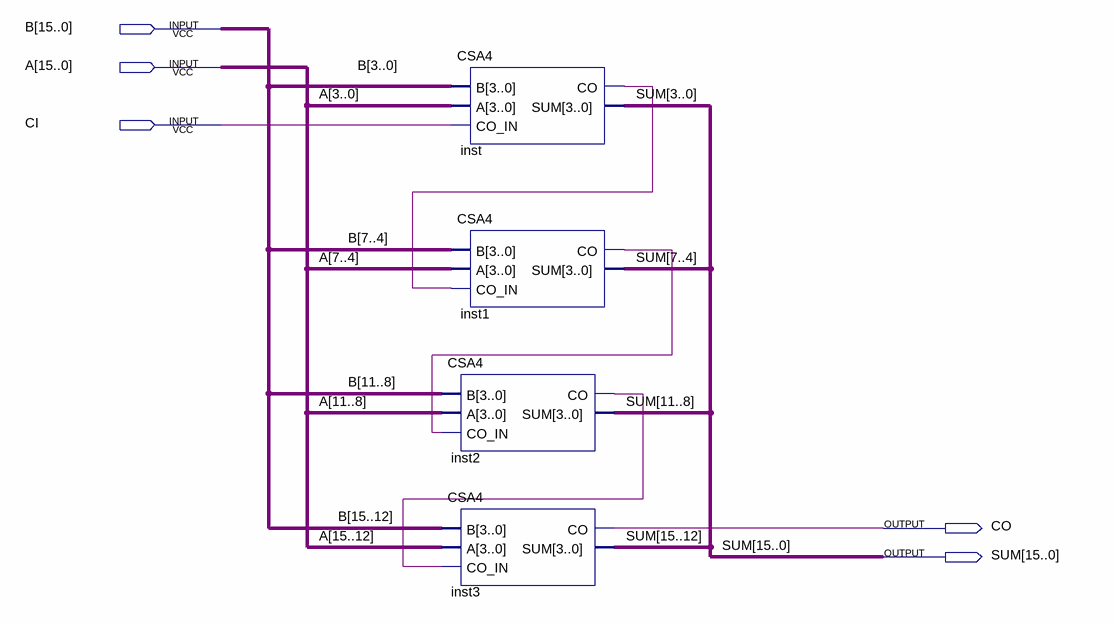
[diagram p0: schematic sheet]
// Quartus schematic CSA16.bdf as structural Verilog: 4 symbols, 5 pins
module CSA16 (
  input  [15:0] B,
  input  [15:0] A,
  input  CI,
  output CO,
  output [15:0] SUM
);

  wire inst1_co, inst2_co, inst_co;

  CSA4 inst (.B(B[3:0]), .A(A[3:0]), .CO_IN(CI), .CO(inst_co), .SUM(SUM[3:0]));
  CSA4 inst1 (.B(B[7:4]), .A(A[7:4]), .CO_IN(inst_co), .CO(inst1_co), .SUM(SUM[7:4]));
  CSA4 inst2 (.B(B[11:8]), .A(A[11:8]), .CO_IN(inst1_co), .CO(inst2_co), .SUM(SUM[11:8]));
  CSA4 inst3 (.B(B[15:12]), .A(A[15:12]), .CO_IN(inst2_co), .CO(CO), .SUM(SUM[15:12]));
endmodule
